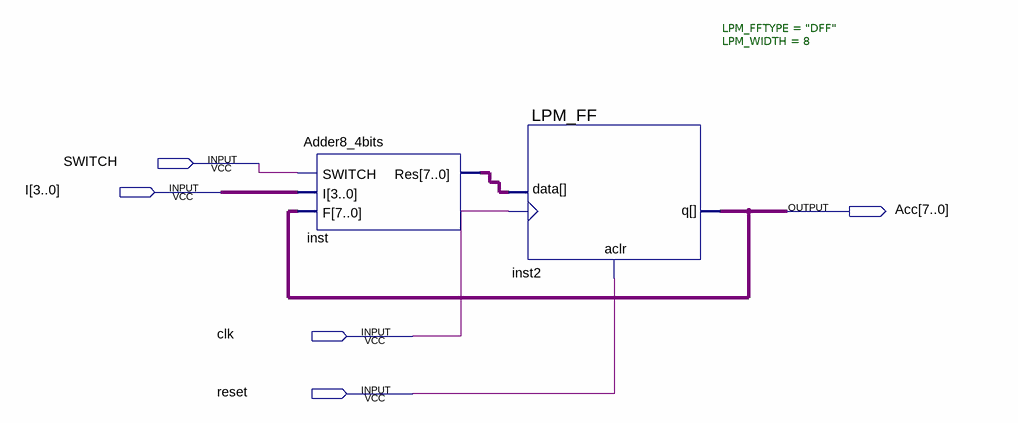
[diagram p0: schematic sheet]
// Quartus schematic Accumulator.bdf as structural Verilog: 2 symbols, 5 pins
module Accumulator (
  input  SWITCH,
  input  [3:0] I,
  input  clk,
  input  reset,
  output [7:0] Acc
);

  wire [7:0] inst_res;

  Adder8_4bits inst (.SWITCH(SWITCH), .I(I), .F(Acc), .Res(inst_res));
  LPM_FF #(.LPM_FFTYPE("DFF"), .LPM_WIDTH(8)) inst2 (.aclr(reset), .clock(clk), .data(inst_res), .q(Acc));
endmodule
